# Altium schematic sheet InterfaceExtension.SchDoc
size A3; Organization: Altium Limited; Address1: Laboratoire de Systèmes Embarqués; Address2: 7, rue de la Serre; Address3: 2610 Saint-Imier / Switzerland; PageSetup: Record=PageOptions|CenterHorizontal=True|CenterVertical=True|PrintScale=0.24|XCorrection=1.00|YCorrection=1.00|PrintKind=0|BorderSize=5000000|LeftOffset=0|BottomOffset=0|Orientation=2|PaperLength=1000|PaperWidth=1000|Scale=100|PaperSource=7|PrintQuality=-4|MediaType=1|DitherType=10|PaperKind=A4|PrintScaleMode=1
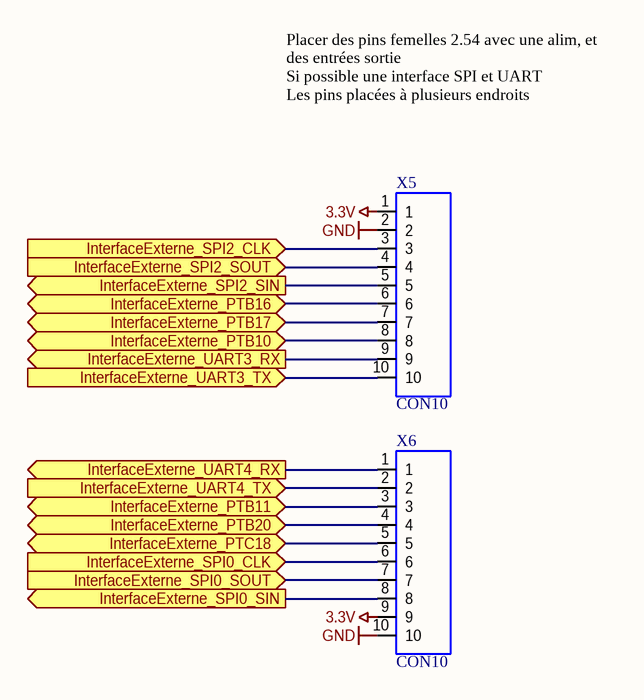
[diagram p0: InterfaceExtension.SchDoc]

## Parts
X5  CON10  [SIP10]
X6  CON10  [SIP10]

## Ports
InterfaceExterne_PTB10 (bidir), InterfaceExterne_PTB11 (bidir), InterfaceExterne_PTB16 (bidir), InterfaceExterne_PTB17 (bidir), InterfaceExterne_PTB20 (bidir), InterfaceExterne_PTC18 (bidir), InterfaceExterne_SPI0_CLK (in), InterfaceExterne_SPI0_SIN (out), InterfaceExterne_SPI0_SOUT (in), InterfaceExterne_SPI2_CLK (in), InterfaceExterne_SPI2_SIN (out), InterfaceExterne_SPI2_SOUT (in), InterfaceExterne_UART3_RX (out), InterfaceExterne_UART3_TX (in), InterfaceExterne_UART4_RX (out), InterfaceExterne_UART4_TX (in)

## Nets
3.3V: X5.1 X6.9
GND: X5.2 X6.10
InterfaceExterne_PTB10: X5.8 ; port InterfaceExterne_PTB10
InterfaceExterne_PTB11: X6.3 ; port InterfaceExterne_PTB11
InterfaceExterne_PTB16: X5.6 ; port InterfaceExterne_PTB16
InterfaceExterne_PTB17: X5.7 ; port InterfaceExterne_PTB17
InterfaceExterne_PTB20: X6.4 ; port InterfaceExterne_PTB20
InterfaceExterne_PTC18: X6.5 ; port InterfaceExterne_PTC18
InterfaceExterne_SPI0_CLK: X6.6 ; port InterfaceExterne_SPI0_CLK
InterfaceExterne_SPI0_SIN: X6.8 ; port InterfaceExterne_SPI0_SIN
InterfaceExterne_SPI0_SOUT: X6.7 ; port InterfaceExterne_SPI0_SOUT
InterfaceExterne_SPI2_CLK: X5.3 ; port InterfaceExterne_SPI2_CLK
InterfaceExterne_SPI2_SIN: X5.5 ; port InterfaceExterne_SPI2_SIN
InterfaceExterne_SPI2_SOUT: X5.4 ; port InterfaceExterne_SPI2_SOUT
InterfaceExterne_UART3_RX: X5.9 ; port InterfaceExterne_UART3_RX
InterfaceExterne_UART3_TX: X5.10 ; port InterfaceExterne_UART3_TX
InterfaceExterne_UART4_RX: X6.1 ; port InterfaceExterne_UART4_RX
InterfaceExterne_UART4_TX: X6.2 ; port InterfaceExterne_UART4_TX

## Notes on the sheet
- Placer des pins femelles 2.54 avec une alim, et des entrées sortie
  Si possible une interface SPI et UART
  Les pins placées à plusieurs endroits
- Title
- Size:
- Date:
- A3
- Author:
- Time:
- Revision:
- Sheet
- of
- File:

## Library data of the parts
X5 X6 = CON10: Right: 30; Bottom: 110; EtatCommande: Interne